# EasyEDA Pro project ProPrj_承载我所有幻想的键盘_2025-02-09.epro, schematic 03-Schematic

## Sheets
1 AU_ADC: Create Date: 2024-07-30; Page Name: AU_ADC; Project Name: 承载我所有幻想的键盘; Schematic Name: 03-Schematic; Update Date: 2024-07-30; Company: 嘉立创EDA
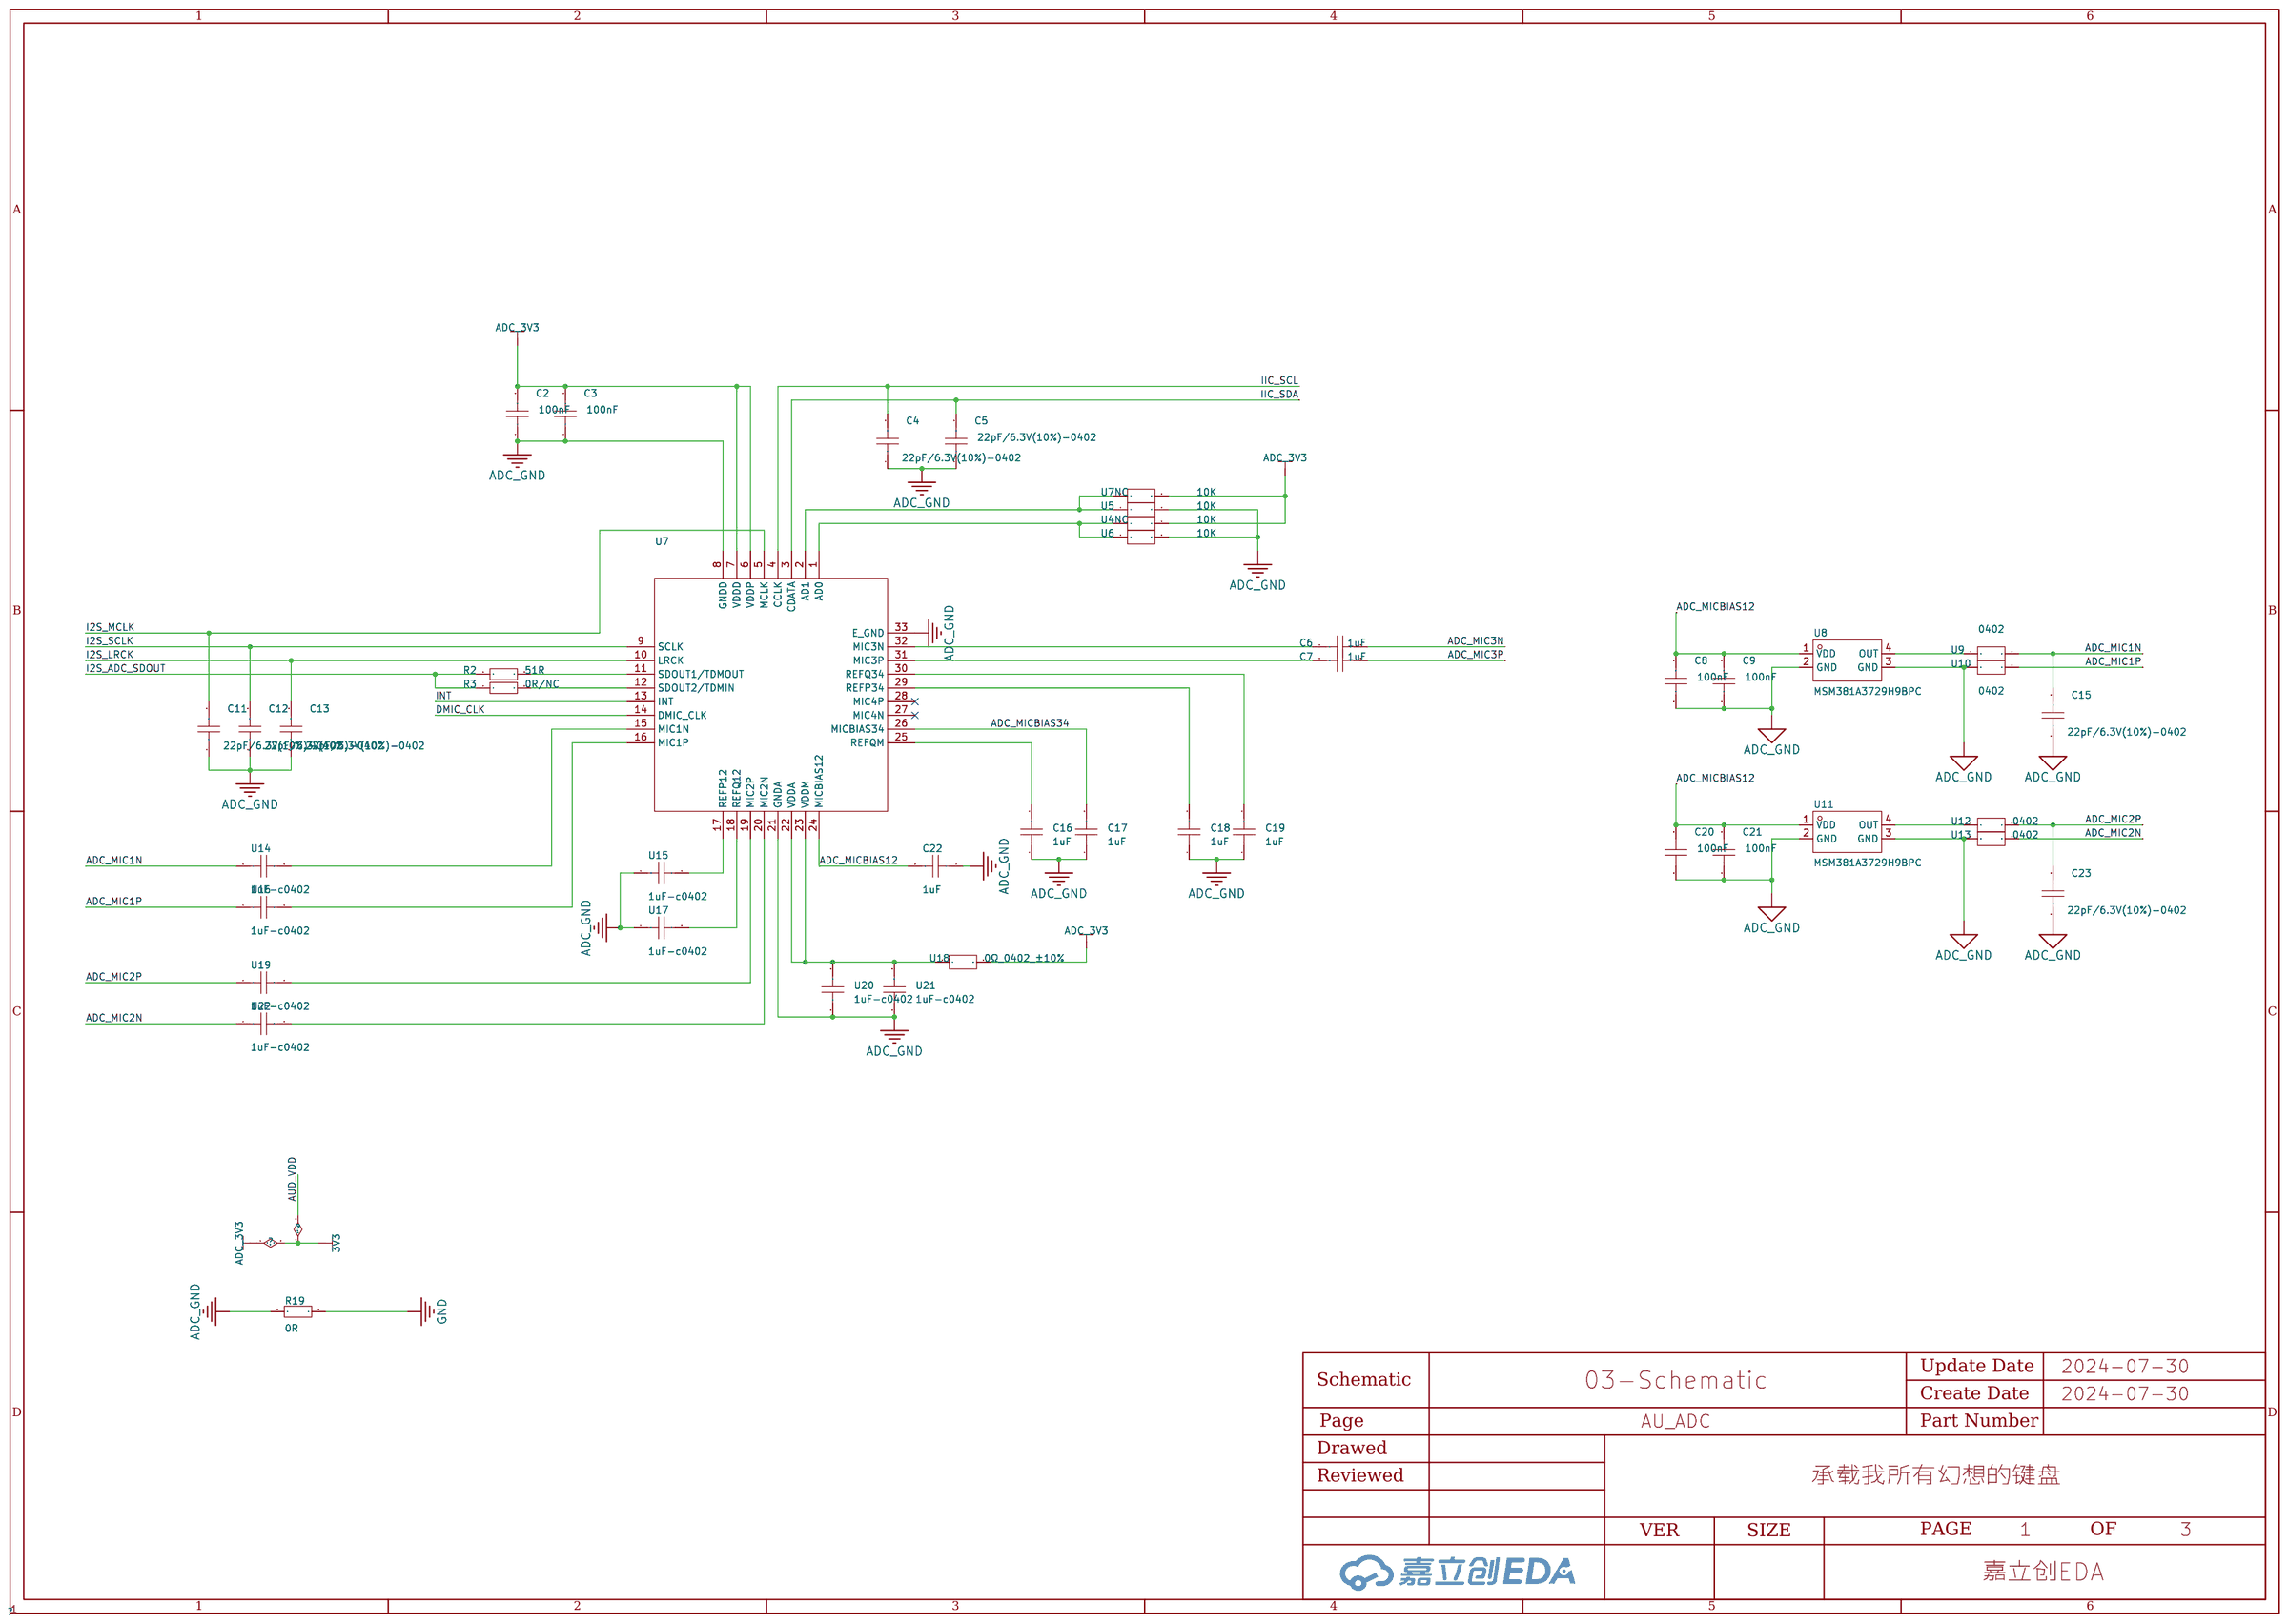
[diagram p9: AU_ADC]
2 AU_DAC: Create Date: 2024-05-15; Page Name: AU_DAC; Project Name: 火星号键盘V2; Schematic Name: Schematic12_1; Update Date: 2024-05-27
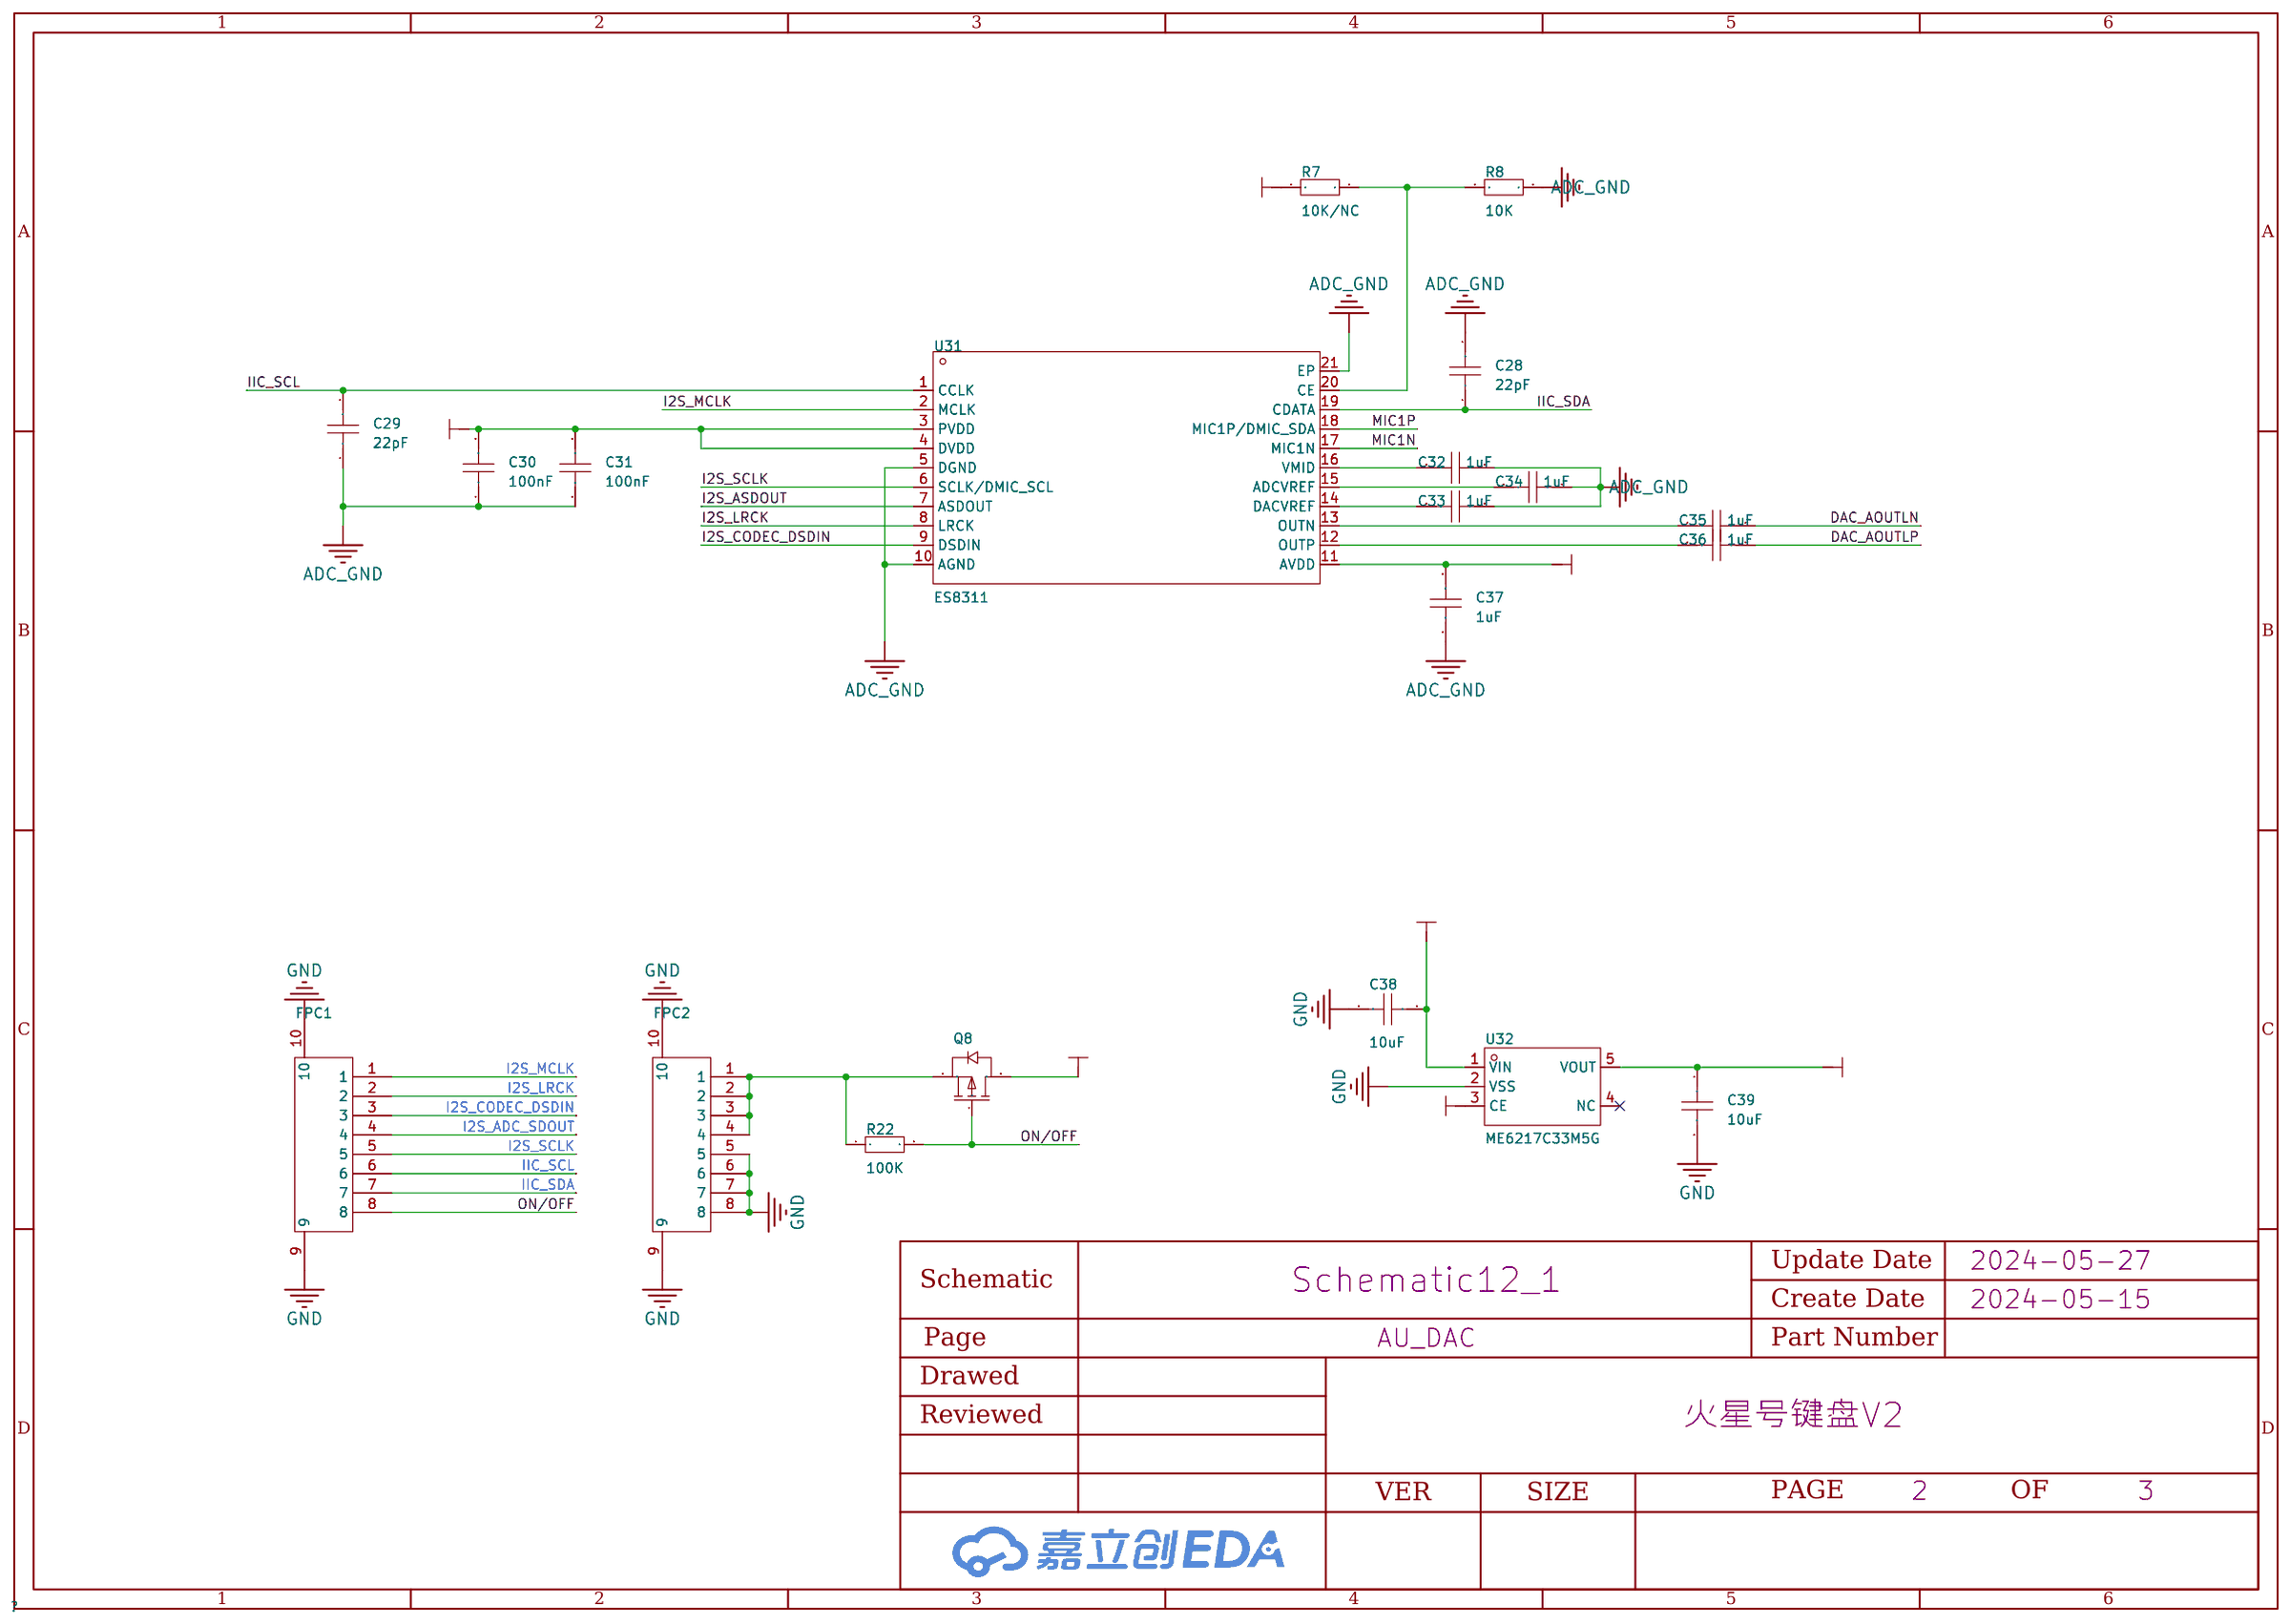
[diagram p10: AU_DAC]
3 AU_AEC+PA: Create Date: 2024-04-21; Page Name: AU_AEC+PA; Project Name: 火星号键盘V2; Schematic Name: Schematic12; Update Date: 2024-04-21; Page Size: A4; Version: V1.0
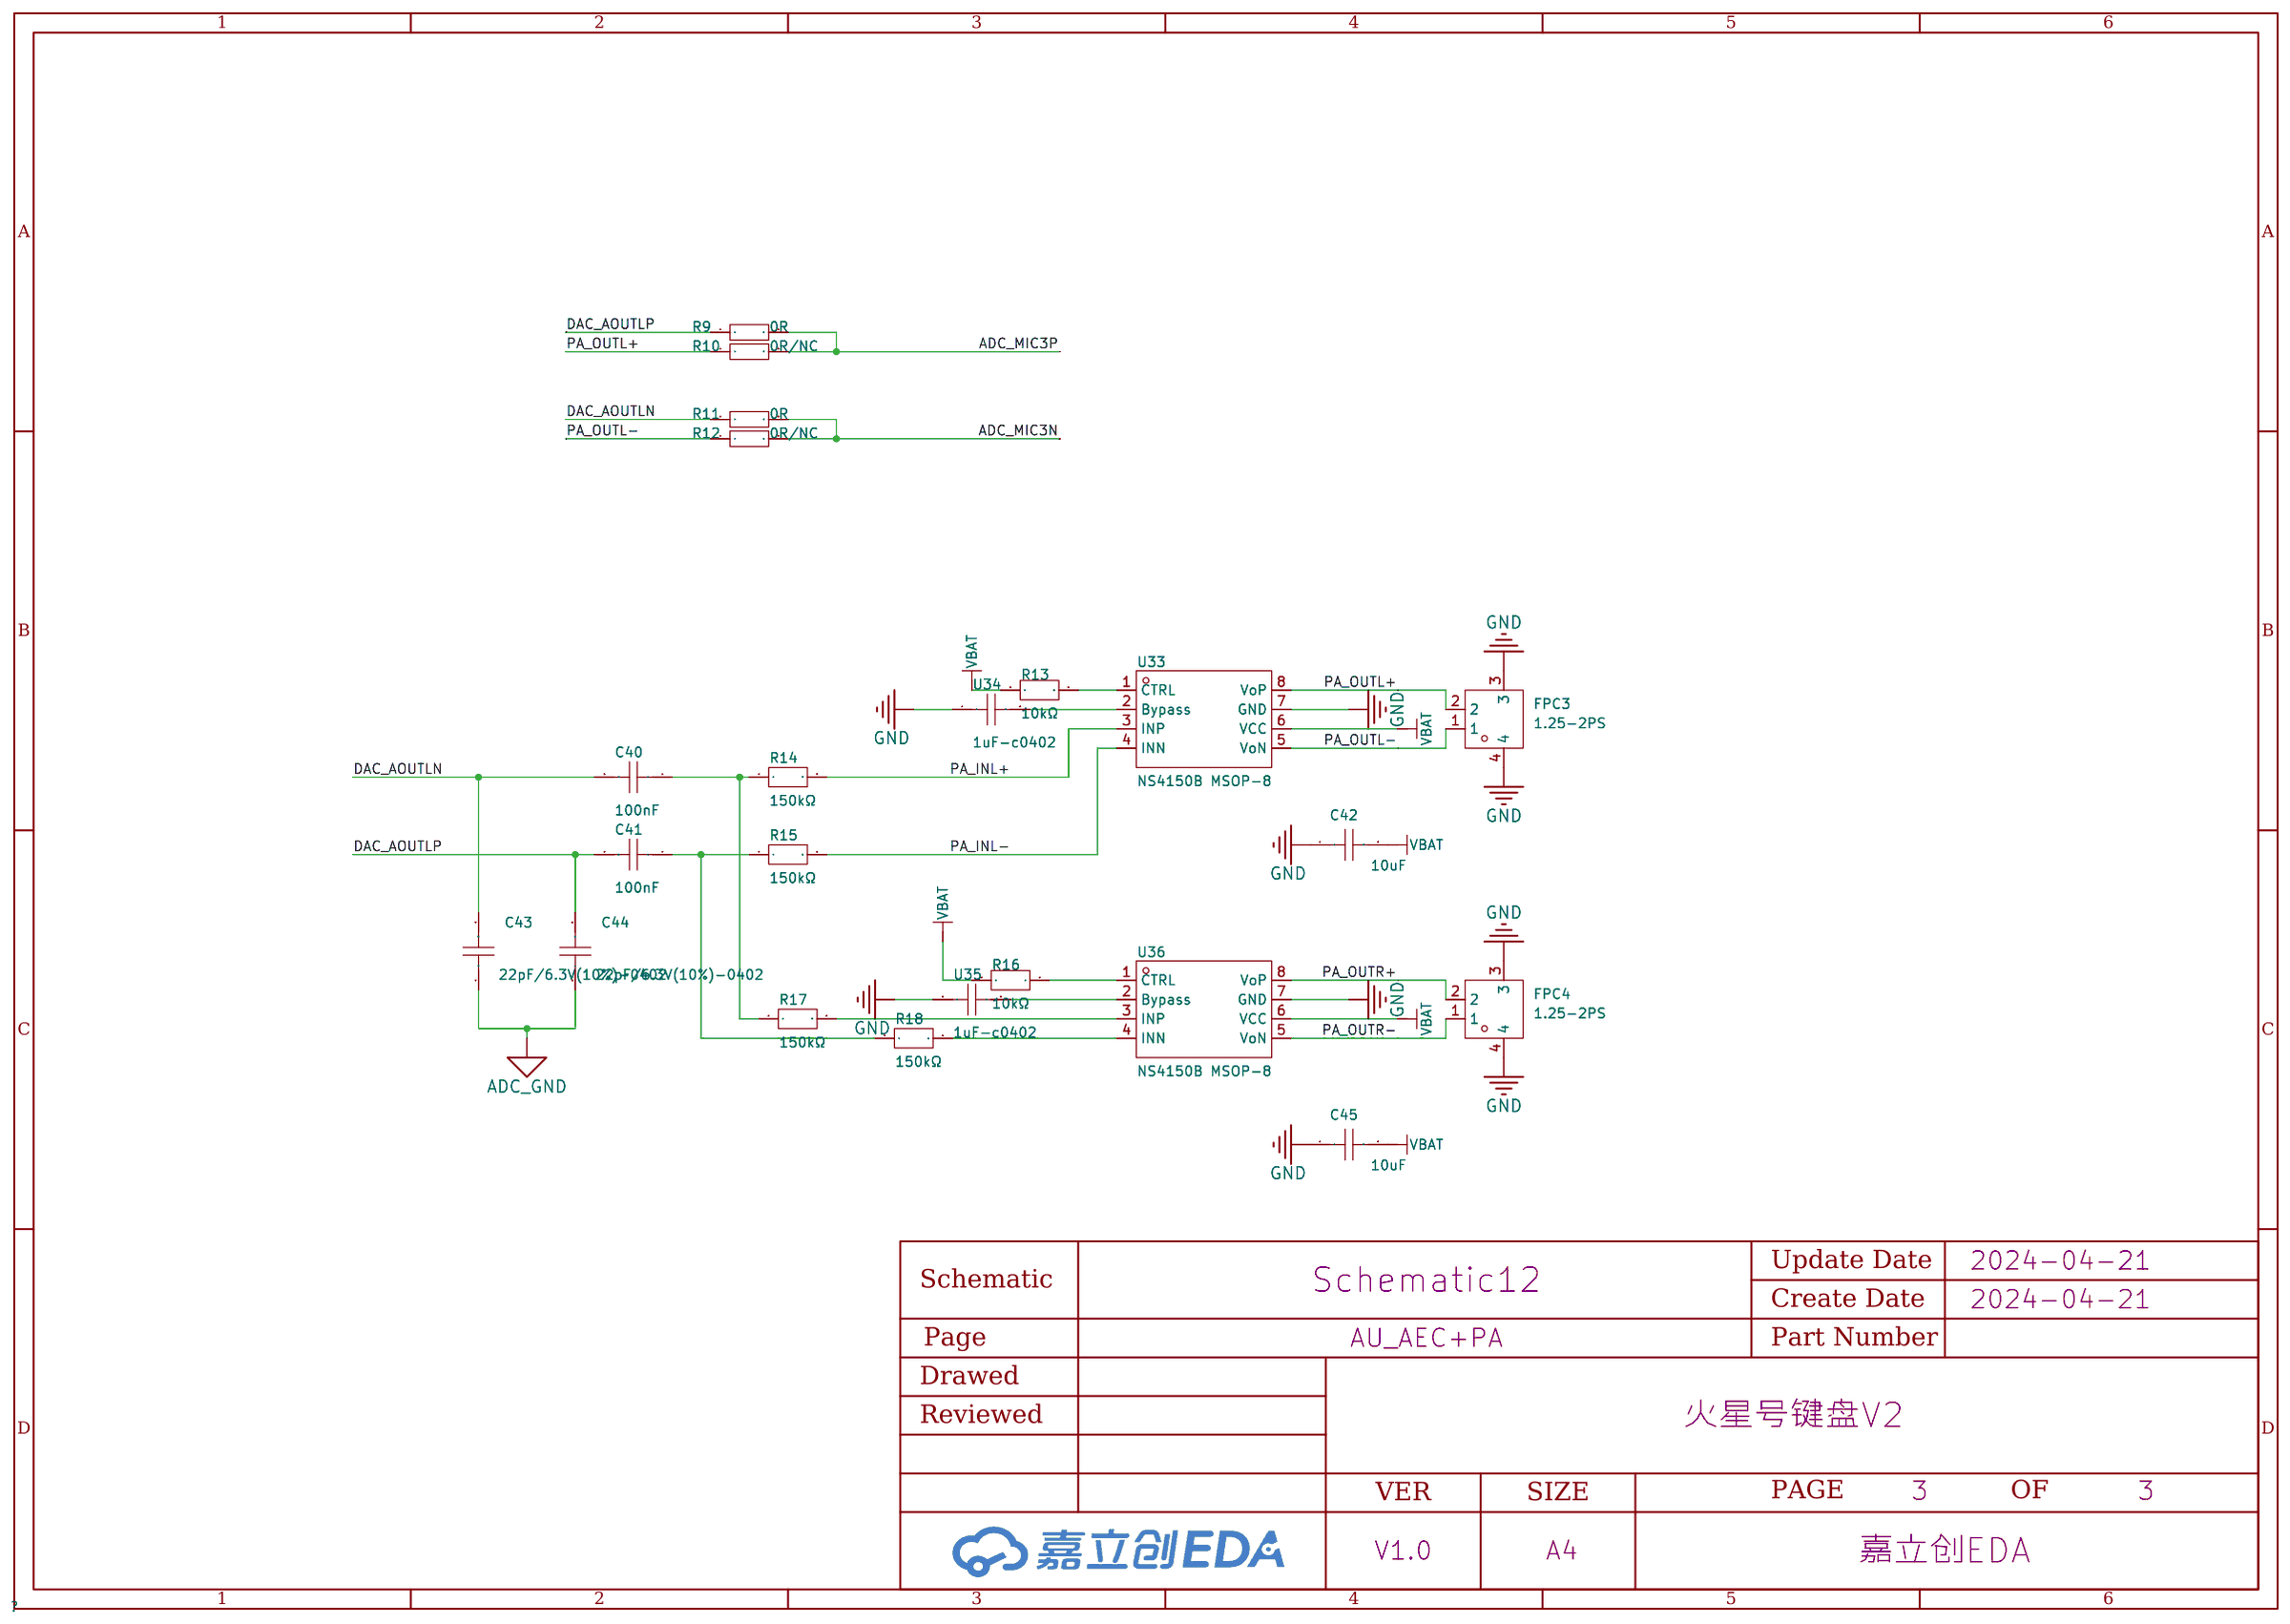
[diagram p11: AU_AEC+PA]

## Parts
sheet AU_ADC
C2  100nF  [C0402]
C3  100nF  [C0402]
C4  22pF/6.3V(10%)-0402  [C0402]
C5  22pF/6.3V(10%)-0402  [C0402]
C6  1uF  [C0402]
C7  1uF  [C0402]
C8  100nF  [C0402]
C9  100nF  [C0402]
C11  22pF/6.3V(10%)-0402  [C0402]
C12  22pF/6.3V(10%)-0402  [C0402]
C13  22pF/6.3V(10%)-0402  [C0402]
C15  22pF/6.3V(10%)-0402  [C0402]
C16  1uF  [C0402]
C17  1uF  [C0402]
C18  1uF  [C0402]
C19  1uF  [C0402]
C20  100nF  [C0402]
C21  100nF  [C0402]
C22  1uF  [C0402]
C23  22pF/6.3V(10%)-0402  [C0402]
R2  51R  [R0402]
R3  0R/NC  [R0402]
R19  0R  [R0402]
U4NC  10K  [R0402]
U5  10K  [R0402]
U6  10K  [R0402]
U7  -  [QFN-32_L4.0-W4.0-P0.40-TL-EP2.9]
U7NC  10K  [R0402]
U8  MSM381A3729H9BPC  [MIC-SMD_4P-L3.8-W3.0-P1.70-TL-S2.46]
U9  0402  [R0402]
U10  0402  [R0402]
U11  MSM381A3729H9BPC  [MIC-SMD_4P-L3.8-W3.0-P1.70-TL-S2.46]
U12  0402  [R0402]
U13  0402  [R0402]
U14  1uF-c0402  [C0402]
U15  1uF-c0402  [C0402]
U16  1uF-c0402  [C0402]
U17  1uF-c0402  [C0402]
U18  0Ω_0402_±10%  [R0402]
U19  1uF-c0402  [C0402]
U20  1uF-c0402  [C0402]
U21  1uF-c0402  [C0402]
U22  1uF-c0402  [C0402]
sheet AU_AEC+PA
C40  100nF  [C0402]
C41  100nF  [C0402]
C42  10uF  [C0402]
C43  22pF/6.3V(10%)-0402  [C0402]
C44  22pF/6.3V(10%)-0402  [C0402]
C45  10uF  [C0402]
FPC3  1.25-2PS  [CONN-SMD_2P-P1.25_DEALON_1.25-2PS]
FPC4  1.25-2PS  [CONN-SMD_2P-P1.25_DEALON_1.25-2PS]
R9  0R  [R0402]
R10  0R/NC  [R0402]
R11  0R  [R0402]
R12  0R/NC  [R0402]
R13  10kΩ  [R0402]
R14  150kΩ  [R0402]
R15  150kΩ  [R0402]
R16  10kΩ  [R0402]
R17  150kΩ  [R0402]
R18  150kΩ  [R0402]
U33  NS4150B MSOP-8  [MSOP-8_L3.0-W3.0-P0.65-LS4.9-BL]
U34  1uF-c0402  [C0402]
U35  1uF-c0402  [C0402]
U36  NS4150B MSOP-8  [MSOP-8_L3.0-W3.0-P0.65-LS4.9-BL]
sheet AU_DAC
C28  22pF  [C0402]
C29  22pF  [C0402]
C30  100nF  [C0402]
C31  100nF  [C0402]
C32  1uF  [C0402]
C33  1uF  [C0402]
C34  1uF  [C0402]
C35  1uF  [C0402]
C36  1uF  [C0402]
C37  1uF  [C0402]
C38  10uF  [C0402]
C39  10uF  [C0402]
FPC1  -  [FPC-SMD_P0.50-8P_FGS-XJ-H2.0]
FPC2  -  [FPC-SMD_P0.50-8P_FGS-XJ-H2.0]
Q8  3401  [SOT-23-3_L2.9-W1.3-P1.90-LS2.4-BR]
R7  10K/NC  [R0402]
R8  10K  [R0402]
R22  100K  [R0402]
U31  ES8311  [WQFN-20_L3.0-W3.0-P0.40-BL-EP1.7]
U32  ME6217C33M5G  [SOT-23-5_L3.0-W1.7-P0.95-LS2.8-BR]

## Library data of the parts
C2 C3 C8 C9 C20 C21 C40 C41 = CL05B104KB54PNC: 容值:100nF;精度:±10%;额定电压:50V;材质(温度系数):X7R;; LCSC Part Name: 100nF ±10% 50V; Supplier Part: C307331; Manufacturer: SAMSUNG(三星); Supplier Footprint: 0402; JLCPCB Part Class: 基础库; Datasheet: https://atta.szlcsc.com/upload/public/pdf/source/20181009/C307331_222F7C870FD3EA5F46F538B483443886.pdf; Supplier: LCSC; Tolerance: ±10%; Voltage Rated: 50V; Temperature Coefficient: X7R
C4 C5 C11-C13 C15 C23 C43 C44 = 22pF/6.3V(10%)-0402: Supplier Part: C9900004403; JLCPCB Part Class: 扩展库; Datasheet: https://atta.szlcsc.comnull; Supplier: LCSC
C6 C7 C16-C19 C22 C28-C37 = CAP_0402: Supplier Footprint: 0402
R2 R3 R7-R12 R19 R22 = Res_0402: Supplier Footprint: 0402
U4NC U5 U6 U7NC U9 U10 U12 U13 = 0402: Supplier Part: C9900015844; JLCPCB Part Class: 扩展库; Datasheet: https://atta.szlcsc.comnull; Supplier: LCSC
U7 = ES7210
U8 U11 = MSM381A3729H9BPC: Supplier Part: C4747982; Supplier Footprint: SMD-4P; JLCPCB Part Class: 扩展库; Datasheet: https://atta.szlcsc.comnull; Supplier: LCSC
U14-U17 U19-U22 U34 U35 = 1uF-c0402: Supplier Part: C9900009000; JLCPCB Part Class: 扩展库; Datasheet: https://atta.szlcsc.comnull; Supplier: LCSC
U18 = 0Ω_0402_±10%: Supplier Part: C9900019101; JLCPCB Part Class: 扩展库; Datasheet: https://atta.szlcsc.comnull; Supplier: LCSC
C42 C45 = ZRB15XR61A106ME01D: 容值:10uF;精度:±20%;额定电压:-;材质(温度系数):-;; LCSC Part Name: 10uF ±20%; Supplier Part: C527590; Manufacturer: muRata(村田); Supplier Footprint: 0402; JLCPCB Part Class: 扩展库; Datasheet: https://atta.szlcsc.com/upload/public/pdf/source/20200507/C527590_05B2D18D24F6232E70970638CDBF66E1.pdf; Supplier: LCSC; Tolerance: ±20%
FPC3 FPC4 = 1.25-2PS: 插针结构:1x2P;间距:1.25mm;安装方式:立贴;参考系列:-;总PIN数:2P;排数:1;每排PIN数:2;行距:-;额定电流:-;工作温度范围:-65℃~+125℃;; LCSC Part Name: 1x2P 间距:1.25mm 立贴; Supplier Part: C2904989; Manufacturer: DEALON(德艺隆); Supplier Footprint: SMD,P=1.25mm; JLCPCB Part Class: 扩展库; Datasheet: https://atta.szlcsc.com/upload/public/pdf/source/20240104/319D8B214BA1AD300ADD00F342A039CD.pdf; Supplier: LCSC; Pins Structure: 1x2P; Pitch: 1.25mm; Mounting Style: 立贴; Number of Pins: 2P; Number of Rows: 1; Number of PINs Per Row: 2; Operating Temperature Range: -65℃~+125℃
R13 R16 = RT0402FRE0710KL: 电阻类型:薄膜电阻;阻值:10kΩ;精度:±1%;功率:62.5mW;温度系数:±50ppm/;最大工作电压:50V;工作温度范围:-55~+155;; LCSC Part Name: 10kΩ ±1% 62.5mW; Supplier Part: C723366; Manufacturer: YAGEO(国巨); Supplier Footprint: 0402; JLCPCB Part Class: 扩展库; Datasheet: https://atta.szlcsc.com/upload/public/pdf/source/20200814/C723366_2D62F0A7D79A791358B4EAA5C31B4231.pdf; Supplier: LCSC; Type: 薄膜电阻; Tolerance: ±1%; Power(Watts): 62.5mW; Temperature Coefficient: ±50ppm/; Overload Voltage (Max): 50V; Operating Temperature Range: -55~+155
R14 R15 R17 R18 = CR0402F150KQ10Z: 阻值:150kΩ;精度:±1%;功率:63mW;温度系数:±100ppm/;; LCSC Part Name: 150kΩ ±1% 63mW; Supplier Part: C881215; Manufacturer: EVER OHMS(天二科技); Supplier Footprint: 0402; JLCPCB Part Class: 扩展库; Datasheet: https://atta.szlcsc.com/upload/public/pdf/source/20201014/C881429_ABC29D63C8D6A11EB63D87348B25AA7B.pdf; Supplier: LCSC; Tolerance: ±1%; Power(Watts): 63mW; Temperature Coefficient: ±100ppm/
U33 U36 = NS4150B MSOP-8: Supplier Part: C2919840; Manufacturer: Nsiway(纳芯威); Supplier Footprint: MSOP-8; JLCPCB Part Class: 扩展库; Datasheet: https://atta.szlcsc.com/upload/public/pdf/source/20211119/AD52B8A601759AE09F3C26DA1A08034B.pdf; Supplier: LCSC
C38 C39 = CL05A106MP5NUNC: 容值:10uF;精度:±20%;额定电压:10V;材质(温度系数):X5R;; LCSC Part Name: 10uF ±20% 10V; Supplier Part: C315248; Manufacturer: SAMSUNG(三星); Supplier Footprint: 0402; JLCPCB Part Class: Extended Part; Datasheet: https://atta.szlcsc.com/upload/public/pdf/source/20200102/C478861_C4302703595930F3C0E62DAD3349F1AA.pdf; Supplier: LCSC; Tolerance: ±20%; Voltage Rated: 10V; Temperature Coefficient: X5R
FPC1 FPC2 = AFC01-S08FCA-00: 间距:0.5mm;触点数量:8;锁定特性:翻盖式;安装类型:卧贴;触点类型:下接;; LCSC Part Name: 0.5mm P数:8 翻盖式 下接; Supplier Part: C262657; Manufacturer: JS(钜硕电子); Supplier Footprint: SMD,P=0.5mm; Datasheet: https://atta.szlcsc.com/upload/public/pdf/source/20180814/C262657_E4DDBFDEF95394073062C4B6399AAD54.pdf; Supplier: LCSC; Pitch: 0.5mm; Number of Contacts: 8; Locking Feature: 翻盖式; Mounting Type: 卧贴; Contact Type: 下接; Height Above Board: 2mm; FFC, FCB Thickness: 0.3mm
Q8 = 3401_C239055: 类型:P沟道;漏源电压(Vdss):30V;连续漏极电流(Id):4.2A;功率(Pd):1.2W;导通电阻(RDS(on)@Vgs,Id):55mΩ@10V,4.2A;阈值电压(Vgs(th)@Id):1.3V@250A;; LCSC Part Name: P沟道 30V 4.2A; Supplier Part: C239055; Manufacturer: GOFORD(谷峰); Supplier Footprint: SOT-23(SOT-23-3); JLCPCB Part Class: Extended Part; Datasheet: https://atta.szlcsc.com/upload/public/pdf/source/20180619/C239055_DDCD8D435643D304BC40BD7DEC0BB420.pdf; Supplier: LCSC; Type: P沟道; Drain Source Voltage (Vdss): 30V; Continuous Drain Current (Id): 4.2A; Power Dissipation (Pd): 1.2W; Drain Source On Resistance (RDS(on)@Vgs,Id): 55mΩ@10V,4.2A; Gate Threshold Voltage (Vgs(th)@Id): 1.3V@250A
U31 = ES8311: Supplier Part: C962342; Manufacturer: Everest-semi(顺芯); Supplier Footprint: WQFN-20-EP(3x3); JLCPCB Part Class: 扩展库; Datasheet: https://atta.szlcsc.com/upload/public/pdf/source/20210630/C962342_E665EAE7274179BC7C5A390EC8AC685C.pdf; Supplier: LCSC
U32 = ME6217C33M5G: 输出类型:固定;输出极性:正;输出通道数:1;最大输入电压:7V;输出电压:3.3V;压差:180mV@(300mA);静态电流(地电流):-;输出电流:800mA;电源纹波抑制比(PRSS):65dB@(1kHz);; LCSC Part Name: Vin=7V Vout=3.3V 800mA 65dB@(1kHz); Supplier Part: C427602; Manufacturer: MICRONE(南京微盟); Supplier Footprint: SOT-23-5; JLCPCB Part Class: 扩展库; Datasheet: https://atta.szlcsc.com/upload/public/pdf/source/20190910/C427602_D4B9162A2E9D9EF57C60010DFDECEF37.pdf; Supplier: LCSC; Output Type: 固定; Output Polarity: 正; Number of Outputs: 1; Maximum Input Voltage: 7V; Output Voltage: 3.3V; Dropout Voltage: 180mV@(300mA); Output Current: 800mA; Power Supply Rejection Ratio (PRSS): 65dB@(1kHz)

## Nets
3V3: C2.2 C3.2 C30.2 C31.2 C37.2 C39.1 R7.1 U4NC.2 U7.6(VDDP) U7.7(VDDD) U7NC.2 U18.2 U31.3(PVDD) U31.4(DVDD) U31.11(AVDD) U32.5(VOUT)
GND: C38.2 C39.2 C42.1 C45.1 FPC1.9 FPC1.10 FPC2.5 FPC2.6 FPC2.7 FPC2.8 FPC2.9 FPC2.10 FPC3.3 FPC3.4 FPC4.3 FPC4.4 R19.2 U32.2(VSS) U33.7(GND) U34.1 U35.1 U36.7(GND)
VBAT: C38.1 C42.2 C45.2 Q8.3(D) R13.1 R16.1 U32.1(VIN) U32.3(CE) U33.6(VCC) U36.6(VCC)
ADC_GND: C2.1 C3.1 C4.1 C5.1 C8.1 C9.1 C11.1 C12.1 C13.1 C15.1 C16.1 C17.1 C18.1 C19.1 C20.1 C21.1 C22.1 C23.1 C28.2 C29.1 C30.1 C31.1 C32.1 C33.1 C34.1 C37.1 C43.1 C44.1 R8.2 R19.1 U5.2 U6.2 U7.8(GNDD) U7.21(GNDA) U7.33(E_GND) U8.2(GND) U8.3(GND) U10.1 U11.2(GND) U11.3(GND) U13.1 U15.1 U17.1 U20.1 U21.1 U31.5(DGND) U31.10(AGND) U31.21(EP)
ADC_MIC1N: C15.2 U9.2 U14.1
ADC_MIC1P: U10.2 U16.1
ADC_MIC2N: U13.2 U22.1
ADC_MIC2P: C23.2 U12.2 U19.1
ADC_MIC3N: C6.2 R11.2 R12.2
ADC_MIC3P: C7.2 R9.2 R10.2
ADC_MICBIAS12: C8.2 C9.2 C20.2 C21.2 C22.2 U7.24(MICBIAS12) U8.1(VDD) U11.1(VDD)
ADC_MICBIAS34: C17.2 U7.26(MICBIAS34)
DAC_AOUTLN: C35.1 C40.2 C43.2 R11.1
DAC_AOUTLP: C36.1 C41.2 C44.2 R9.1
DMIC_CLK: U7.14(DMIC_CLK)
I2S_ADC_SDOUT: FPC1.4 R2.1 R3.1
I2S_ASDOUT: U31.7(ASDOUT)
I2S_CODEC_DSDIN: FPC1.3 U31.9(DSDIN)
I2S_LRCK: C13.2 FPC1.2 U7.10(LRCK) U31.8(LRCK)
I2S_MCLK: C11.2 FPC1.1 U7.5(MCLK) U31.2(MCLK)
I2S_SCLK: C12.2 FPC1.5 U7.9(SCLK) U31.6(SCLK/DMIC_SCL)
IIC_SCL: C4.2 C29.2 FPC1.6 U7.4(CCLK) U31.1(CCLK)
IIC_SDA: C5.2 C28.1 FPC1.7 U7.3(CDATA) U31.19(CDATA)
INT: U7.13(INT)
MIC1N: U31.17(MIC1N)
MIC1P: U31.18(MIC1P/DMIC_SDA)
ON/OFF: FPC1.8 Q8.1(G) R22.2
PA_INL+: R14.2 U33.3(INP)
PA_INL-: R15.2 U33.4(INN)
PA_OUTL+: FPC3.2 R10.1 U33.8(VoP)
PA_OUTL-: FPC3.1 R12.1 U33.5(VoN)
PA_OUTR+: FPC4.2 U36.8(VoP)
PA_OUTR-: FPC4.1 U36.5(VoN)
$2N1613: U5.1 U7.2(AD1) U7NC.1
$2N1625: U4NC.1 U6.1 U7.1(AD0)
$2N4267: R2.2 U7.11(SDOUT1/TDMOUT)
$2N4546: R3.2 U7.12(SDOUT2/TDMIN)
$2N6024: U7.15(MIC1N) U14.2
$2N6071: U7.16(MIC1P) U16.2
$2N6740: U7.17(REFP12) U15.2
$2N6786: U7.18(REFQ12) U17.2
$2N6931: U7.19(MIC2P) U19.2
$2N6979: U7.20(MIC2N) U22.2
$2N7920: U7.22(VDDA) U7.23(VDDM) U18.1 U20.2 U21.2
$2N8622: C16.2 U7.25(REFQM)
$2N9215: C19.2 U7.30(REFQ34)
$2N9522: C18.2 U7.29(REFP34)
$2N9740: C6.1 U7.32(MIC3N)
$2N9801: C7.1 U7.31(MIC3P)
$2N15091: U8.4(OUT) U9.1
$2N15611: U11.4(OUT) U12.1
$3N21498: C36.2 U31.12(OUTP)
$3N21501: C35.2 U31.13(OUTN)
$3N21504: C34.2 U31.15(ADCVREF)
$3N21507: C33.2 U31.14(DACVREF)
$3N21686: C32.2 U31.16(VMID)
$3N21843: R7.2 R8.1 U31.20(CE)
$3N22082: FPC2.1 FPC2.2 FPC2.3 FPC2.4 Q8.2(S) R22.1
$4N941: U33.2(Bypass) U34.2
$4N942: R13.2 U33.1(CTRL)
$4N951: R16.2 U36.1(CTRL)
$4N954: U35.2 U36.2(Bypass)
$4N1245: C40.1 R14.1 R17.1
$4N1246: R17.2 U36.3(INP)
$4N1254: C41.1 R15.1 R18.1
$4N1255: R18.2 U36.4(INN)

Not connected (* = marked no-connect by the designer): U7 27(MIC4N)* 28(MIC4P)*; U32 4(NC)*
